# Altium schematic sheet ESP32_garage_door.SchDoc
size A4; SheetNumber: 1; SheetTotal: 2
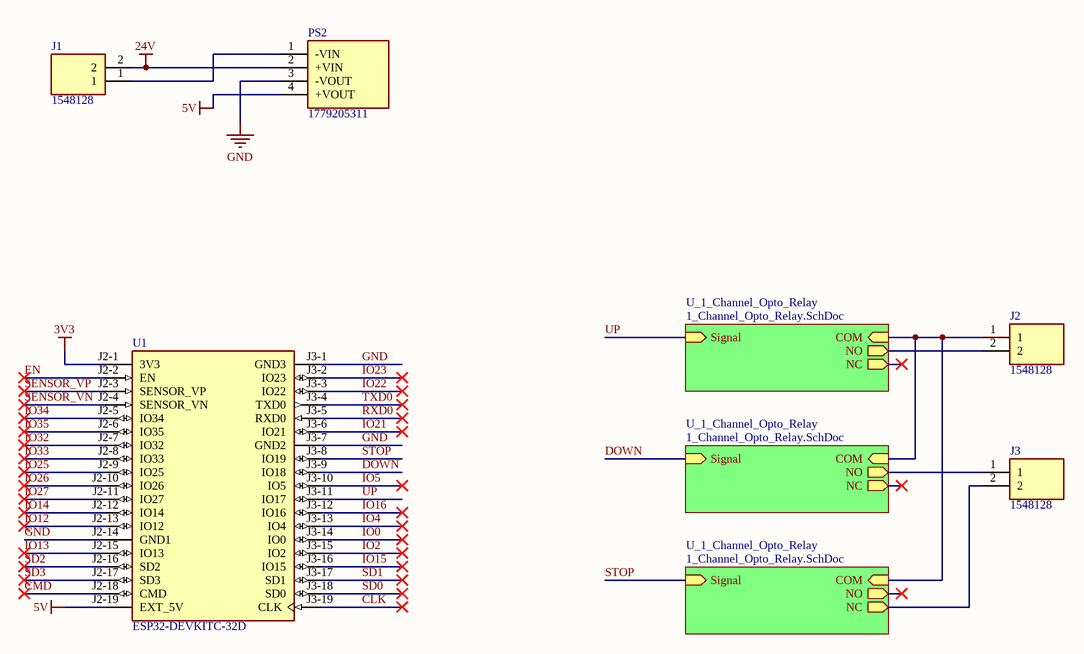
[diagram p0: ESP32_garage_door.SchDoc]

## Parts
J1  1548128  [1548128]
J2  1548128  [1548128]
J3  1548128  [1548128]
PS2  1779205311  [1779205311]
U1  ESP32-DEVKITC-32D  [MODULE_ESP32-DEVKITC-32D]

## Sub-sheets
U_1_Channel_Opto_Relay = 1_Channel_Opto_Relay.SchDoc: Signal (in), COM (in), NO (out), NC (out)
U_1_Channel_Opto_Relay = 1_Channel_Opto_Relay.SchDoc: Signal (in), COM (in), NO (out), NC (out)
U_1_Channel_Opto_Relay = 1_Channel_Opto_Relay.SchDoc: Signal (in), COM (in), NO (out), NC (out)

## Nets
3V3: U1.J2-1(3V3)
5V: PS2.4(+VOUT) U1.J2-19(EXT_5V)
24V: J1.2 PS2.2(+VIN)
GND: PS2.3(-VOUT) U1.J2-14(GND1) U1.J3-1(GND3) U1.J3-7(GND2)
CLK: U1.J3-19(CLK)
CMD: U1.J2-18(CMD)
DOWN: U1.J3-9(IO18) ; sheet U_1_Channel_Opto_Relay/Signal
EN: U1.J2-2(EN)
IO0: U1.J3-14(IO0)
IO2: U1.J3-15(IO2)
IO4: U1.J3-13(IO4)
IO5: U1.J3-10(IO5)
IO12: U1.J2-13(IO12)
IO13: U1.J2-15(IO13)
IO14: U1.J2-12(IO14)
IO15: U1.J3-16(IO15)
IO16: U1.J3-12(IO16)
IO21: U1.J3-6(IO21)
IO22: U1.J3-3(IO22)
IO23: U1.J3-2(IO23)
IO25: U1.J2-9(IO25)
IO26: U1.J2-10(IO26)
IO27: U1.J2-11(IO27)
IO32: U1.J2-7(IO32)
IO33: U1.J2-8(IO33)
IO34: U1.J2-5(IO34)
IO35: U1.J2-6(IO35)
RXD0: U1.J3-5(RXD0)
SD0: U1.J3-18(SD0)
SD1: U1.J3-17(SD1)
SD2: U1.J2-16(SD2)
SD3: U1.J2-17(SD3)
SENSOR_VN: U1.J2-4(SENSOR_VN)
SENSOR_VP: U1.J2-3(SENSOR_VP)
STOP: U1.J3-8(IO19) ; sheet U_1_Channel_Opto_Relay/Signal
TXD0: U1.J3-4(TXD0)
UP: U1.J3-11(IO17) ; sheet U_1_Channel_Opto_Relay/Signal
NetJ1_1: J1.1 PS2.1(-VIN)
NetJ2_1: J2.1 ; sheet U_1_Channel_Opto_Relay/COM, sheet U_1_Channel_Opto_Relay/COM, sheet U_1_Channel_Opto_Relay/COM
NetJ2_2: J2.2 ; sheet U_1_Channel_Opto_Relay/NO
NetJ3_1: J3.1 ; sheet U_1_Channel_Opto_Relay/NO
NetJ3_2: J3.2 ; sheet U_1_Channel_Opto_Relay/NC

## Library data of the parts
J1-J3 = 1548128: Connector; Manufacturer_Name: Phoenix Contact; Datasheet Link: https://product-download.phoenixcontact.com/8064728?response-content-disposition=inline;%20filename%3D%22pxc_1548128_00_05_MKDSN-1-5-2-5-08-SPE_FAM.pdf%22&Expires=1710663383&Signature=dNE3xUpP8aZKNM7MbijW96iZv~1ZSU7z-jr1GpV8auc4knETZVFd79aWCcONAeV4hWLRa32; Height: 10.15mm; Manufacturer_Part_Number: 1548128; Mouser Part Number: 651-1548128; Mouser Price/Stock: https://www.mouser.co.uk/ProductDetail/Phoenix-Contact/1548128?qs=ulEaXIWI0c87QOzP9yohxA%3D%3D
PS2 = 1779205311: Power Supply; Manufacturer_Name: Wurth Elektronik; Datasheet Link: https://www.we-online.com/components/products/datasheet/1779205311.pdf; Height: 10.41mm; Manufacturer_Part_Number: 1779205311
U1 = CMP-005-000000-1: WiFi Development Tools (802.11) ESP32 General Development Kit, ESP32-WROOM-32D on the board; MF: Espressif Systems; Pin Count: 38; Source: ESP32-DEVKITC-32D.SchLib; Check_prices: https://www.snapeda.com/parts/ESP32-DEVKITC-32D/Espressif+Systems/view-part/?ref=eda; Value: *; Package: None; Design Item ID: ESP32-DEVKITC-32D; Component Type: Standard; MP: ESP32-DEVKITC-32D; SnapEDA_Link: https://www.snapeda.com/parts/ESP32-DEVKITC-32D/Espressif+Systems/view-part/?ref=snap